# Altium project ECG BT&USB 12ch.PrjPcb
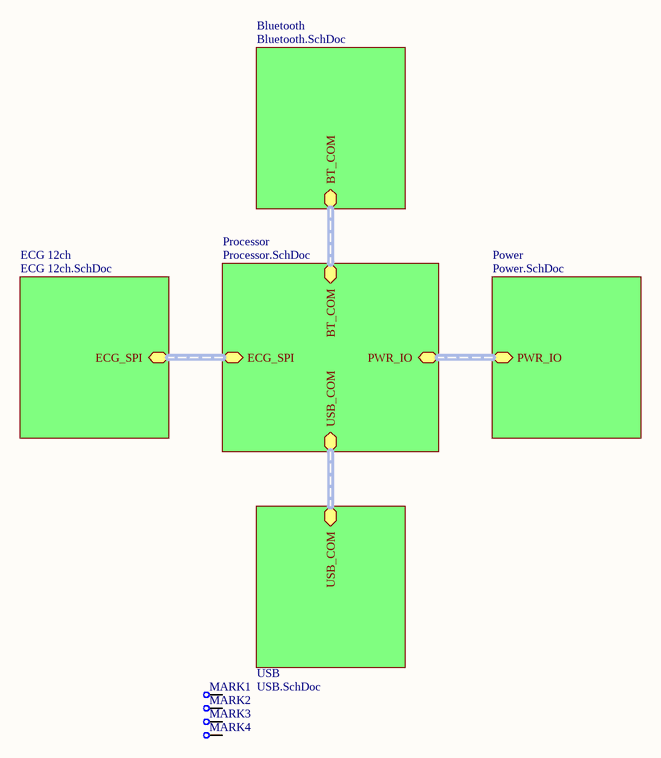
[diagram p0: Main 12ch.SchDoc]
7 sheets, 110 parts. Net scope: hierarchical (ports join the sheet entries above them; power ports are global).
Board file: ECG BT&USB 12ch.PcbDoc
Sheets:
  Main 12ch.SchDoc
    ECG 12ch = ECG 12ch.SchDoc
      Input protect 1 = Input protect.SchDoc
      Input protect 2 = Input protect.SchDoc
      Input protect 4 = Input protect.SchDoc
      Input protect 5 = Input protect.SchDoc
      Input protect 6 = Input protect.SchDoc
      Input protect 7 = Input protect.SchDoc
      Input protect 8 = Input protect.SchDoc
      Input protect 9 = Input protect.SchDoc
      Input protect 10 = Input protect.SchDoc
      Input protect 11 = Input protect.SchDoc
      Input protect 3 = Input protect.SchDoc
      Input connector 12ch = Input connector 12ch.SchDoc
    Processor = Processor.SchDoc
    Bluetooth = Bluetooth.SchDoc
    Power = Power.SchDoc

## Sheet Main 12ch.SchDoc
size A4

### Parts
MARK1  (no value)  [1MM MARK]
MARK2  (no value)  [1MM MARK]
MARK3  (no value)  [1MM MARK]
MARK4  (no value)  [1MM MARK]

### Sub-sheets
Bluetooth = Bluetooth.SchDoc: BT_COM (harness BT_COM)
ECG 12ch = ECG 12ch.SchDoc: ECG_SPI (harness ECG_SPI)
Power = Power.SchDoc: PWR_IO (harness PWR_IO)
Processor = Processor.SchDoc: ECG_SPI (harness ECG_SPI), BT_COM (harness BT_COM), USB_COM (harness USB_COM), PWR_IO (harness PWR_IO)
USB = USB.SchDoc (file not in this document): USB_COM (harness USB_COM)

### Nets

Not connected (* = marked no-connect by the designer): MARK1 1; MARK2 1; MARK3 1; MARK4 1

### Buses and harness runs
harness sheet Bluetooth/BT_COM = sheet Processor/BT_COM
harness sheet ECG 12ch/ECG_SPI = sheet Processor/ECG_SPI
harness sheet Power/PWR_IO = sheet Processor/PWR_IO
harness sheet Processor/USB_COM = sheet USB/USB_COM

### Library data of the parts
MARK1-MARK4 = TP

## Sheet ECG 12ch.SchDoc
size A4
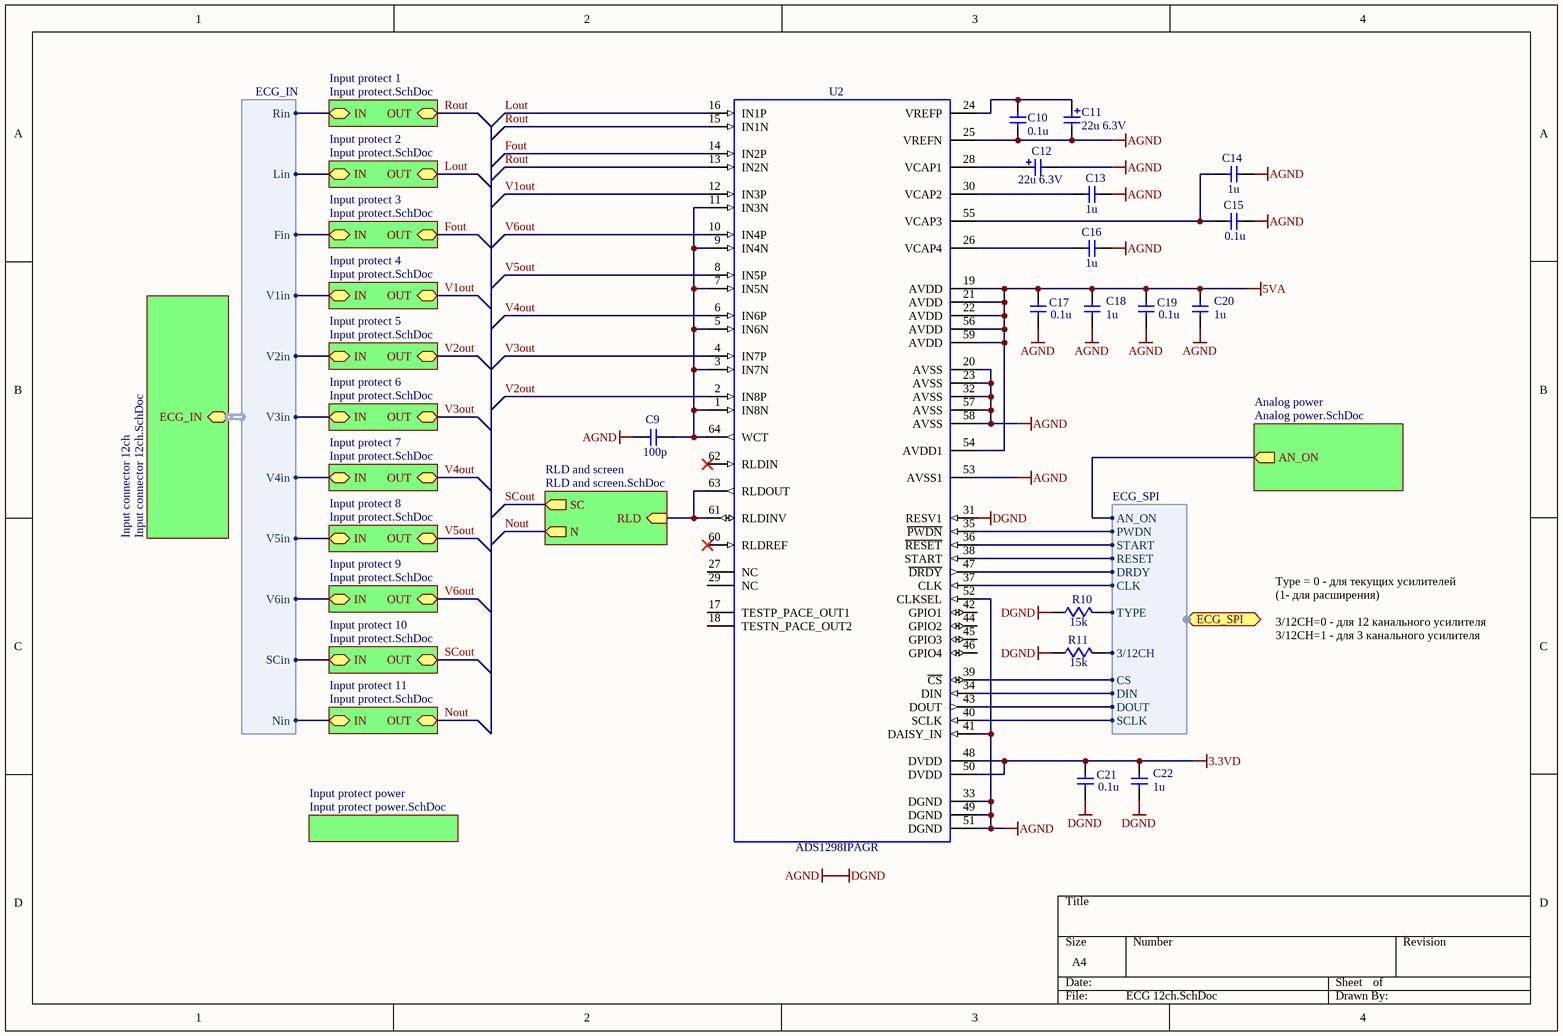
[diagram p1: ECG 12ch.SchDoc]

### Parts
C9  100p  [SMD/C/0603]
C10  0.1u  [SMD/C/0603]
C11  22u 6.3V  [SMD/C/TAJ-A]
C12  22u 6.3V  [SMD/C/TAJ-A]
C13  1u  [SMD/C/0603]
C14  1u  [SMD/C/0603]
C15  0.1u  [SMD/C/0603]
C16  1u  [SMD/C/0603]
C17  0.1u  [SMD/C/0603]
C18  1u  [SMD/C/0603]
C19  0.1u  [SMD/C/0603]
C20  1u  [SMD/C/0603]
C21  0.1u  [SMD/C/0603]
C22  1u  [SMD/C/0603]
R10  15k  [SMD/R/0603]
R11  15k  [SMD/R/0603]
U2  ADS1298IPAGR  [SMD/QFP64/0.5MMP/10x10MM/12X12MMWP]

### Sub-sheets
Analog power = Analog power.SchDoc (file not in this document): AN_ON (out)
Input connector 12ch = Input connector 12ch.SchDoc: ECG_IN (harness ECG_IN)
Input protect 1 = Input protect.SchDoc: IN, OUT
Input protect 2 = Input protect.SchDoc: IN, OUT
Input protect 3 = Input protect.SchDoc: IN, OUT
Input protect 4 = Input protect.SchDoc: IN, OUT
Input protect 5 = Input protect.SchDoc: IN, OUT
Input protect 6 = Input protect.SchDoc: IN, OUT
Input protect 7 = Input protect.SchDoc: IN, OUT
Input protect 8 = Input protect.SchDoc: IN, OUT
Input protect 9 = Input protect.SchDoc: IN, OUT
Input protect 10 = Input protect.SchDoc: IN, OUT
Input protect 11 = Input protect.SchDoc: IN, OUT
Input protect power = Input protect power.SchDoc (file not in this document): no entries
RLD and screen = RLD and screen.SchDoc (file not in this document): SC (out), N (out), RLD (in)

### Ports
ECG_SPI (harness ECG_SPI)

### Harnesses
ECG_SPI: PWDN, START, DRDY, CLK, DIN, CS, DOUT, SCLK, RESET, 3/12CH, TYPE, AN_ON
ECG_IN: Rin, Lin, Fin, V1in, V2in, V3in, V4in, V5in, V6in, SCin, Nin

### Nets
3.3VD: C21.2 C22.2 U2.48(DVDD) U2.50(DVDD)
5VA: C17.2 C18.2 C19.2 C20.2 U2.19(AVDD) U2.21(AVDD) U2.22(AVDD) U2.54(AVDD1) U2.56(AVDD) U2.59(AVDD)
AGND: C9.2 C10.1 C11.M C12.M C13.1 C14.1 C15.1 C16.1 C17.1 C18.1 C19.1 C20.1 C21.1 C22.1 R10.1 R11.1 U2.20(AVSS) U2.23(AVSS) U2.25(VREFN) U2.31(RESV1) U2.32(AVSS) U2.33(DGND) U2.41(DAISY_IN) U2.49(DGND) U2.51(DGND) U2.52(CLKSEL) U2.53(AVSS1) U2.57(AVSS) U2.58(AVSS)  [also labelled DGND]
ECG_ANON: sheet Analog power/AN_ON, port ECG_SPI.AN_ON
ECG_CH: R11.2 ; port ECG_SPI.3/12CH
ECG_CLK: U2.37(CLK) ; port ECG_SPI.CLK
ECG_CS: U2.39(~{CS}) ; port ECG_SPI.CS
ECG_DIN: U2.34(DIN) ; port ECG_SPI.DIN
ECG_DOUT: U2.43(DOUT) ; port ECG_SPI.DOUT
ECG_DRDY: U2.47(~{DRDY}) ; port ECG_SPI.DRDY
ECG_PWDN: U2.35(~{PWDN}) ; port ECG_SPI.PWDN
ECG_RST: U2.38(START) ; port ECG_SPI.RESET
ECG_SCLK: U2.40(SCLK) ; port ECG_SPI.SCLK
ECG_STRT: U2.36(~{RESET}) ; port ECG_SPI.START
ECG_TYPE: R10.2 ; port ECG_SPI.TYPE
Fout: U2.14(IN2P) ; sheet Input protect 3/OUT
Lout: U2.16(IN1P) ; sheet Input protect 2/OUT
Nout: sheet Input protect 11/OUT, sheet RLD and screen/N
Rout: U2.13(IN2N) U2.15(IN1N) ; sheet Input protect 1/OUT
SCout: sheet Input protect 10/OUT, sheet RLD and screen/SC
V1out: U2.12(IN3P) ; sheet Input protect 4/OUT
V2out: U2.2(IN8P) ; sheet Input protect 5/OUT
V3out: U2.4(IN7P) ; sheet Input protect 6/OUT
V4out: U2.6(IN6P) ; sheet Input protect 7/OUT
V5out: U2.8(IN5P) ; sheet Input protect 8/OUT
V6out: U2.10(IN4P) ; sheet Input protect 9/OUT
NetC9_1: C9.1 U2.1(IN8N) U2.3(IN7N) U2.5(IN6N) U2.7(IN5N) U2.9(IN4N) U2.11(IN3N) U2.64(WCT)
NetC10_2: C10.2 C11.P U2.24(VREFP)
NetC12_P: C12.P U2.28(VCAP1)
NetC13_2: C13.2 U2.30(VCAP2)
NetC14_2: C14.2 C15.2 U2.55(VCAP3)
NetC16_2: C16.2 U2.26(VCAP4)
NetR1.1_1: sheet Input protect 1/IN, sheet Input connector 12ch/ECG_IN.Rin
NetR1.2_1: sheet Input protect 2/IN, sheet Input connector 12ch/ECG_IN.Lin
NetR1.3_1: sheet Input protect 4/IN, sheet Input connector 12ch/ECG_IN.V1in
NetR1.4_1: sheet Input protect 5/IN, sheet Input connector 12ch/ECG_IN.V2in
NetR1.5_1: sheet Input protect 6/IN, sheet Input connector 12ch/ECG_IN.V3in
NetR1.6_1: sheet Input protect 7/IN, sheet Input connector 12ch/ECG_IN.V4in
NetR1.7_1: sheet Input protect 8/IN, sheet Input connector 12ch/ECG_IN.V5in
NetR1.8_1: sheet Input protect 9/IN, sheet Input connector 12ch/ECG_IN.V6in
NetR1.9_1: sheet Input protect 10/IN, sheet Input connector 12ch/ECG_IN.SCin
NetR1.10_1: sheet Input protect 11/IN, sheet Input connector 12ch/ECG_IN.Nin
NetR1.11_1: sheet Input protect 3/IN, sheet Input connector 12ch/ECG_IN.Fin
NetU2_61: U2.61(RLDINV) U2.63(RLDOUT) ; sheet RLD and screen/RLD

Not connected (* = marked no-connect by the designer): U2 17(TESTP_PACE_OUT1) 18(TESTN_PACE_OUT2) 27(NC) 29(NC) 42(GPIO1) 44(GPIO2) 45(GPIO3) 46(GPIO4) 60(RLDREF)* 62(RLDIN)*

### Notes on the sheet
- Type = 0 - для текущих усилителей
  (1- для расширения)
  3/12CH=0 - для 12 канального усилителя
  3/12CH=1 - для 3 канального усилителя

### Library data of the parts
C9 C10 C13-C22 = Capacitor
  C9: Value: 100p
  C10 C15 C17 C19 C21: Value: 0.1u
  C13 C14 C16 C18 C20 C22: Value: 1u
C11 C12 = Capacitor Pol: Value: 22u 6.3V
R10 R11 = Resistor: Value: 15k
U2 = ADS1298IPAGR: Interleaving Continuous Conduction Mode PFC Controller; Value: ADS1298IPAGR

## Sheet Input protect.SchDoc
size A4
Used 11 times, as channels ECG 12ch/Input protect 1, ECG 12ch/Input protect 2, ECG 12ch/Input protect 4, ECG 12ch/Input protect 5, ECG 12ch/Input protect 6, ECG 12ch/Input protect 7, ECG 12ch/Input protect 8, ECG 12ch/Input protect 9, ECG 12ch/Input protect 10, ECG 12ch/Input protect 11, ECG 12ch/Input protect 3. Parts and nets are listed once, with the designators drawn on the sheet.
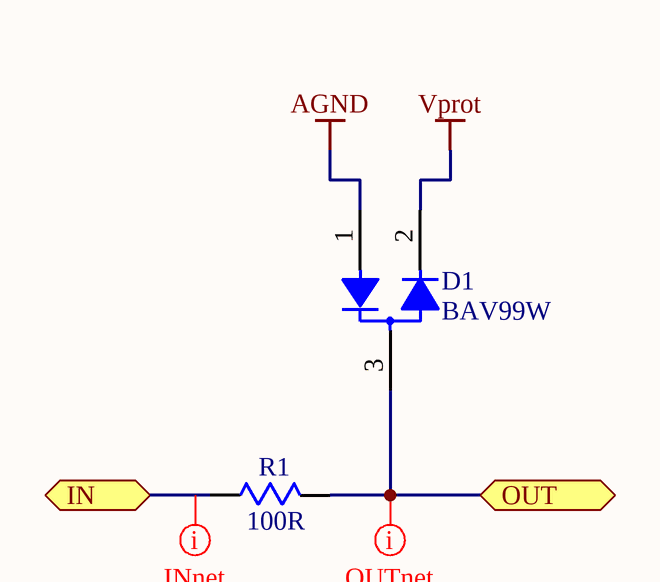
[diagram p2: Input protect.SchDoc]

### Parts
D1  BAV99W  [SMD/SOT323]
R1  100R  [SMD/R/0805]

### Ports
IN, OUT

### Nets
AGND: D1.1
Vprot: D1.2
IN: R1.1 ; port IN
OUT: D1.3 R1.2 ; port OUT

### Channels
ECG 12ch/Input protect 1: designators end in .1; ports IN=NetR1.1_1 OUT=Rout
ECG 12ch/Input protect 2: designators end in .2; ports IN=NetR1.2_1 OUT=Lout
ECG 12ch/Input protect 4: designators end in .3; ports IN=NetR1.3_1 OUT=V1out
ECG 12ch/Input protect 5: designators end in .4; ports IN=NetR1.4_1 OUT=V2out
ECG 12ch/Input protect 6: designators end in .5; ports IN=NetR1.5_1 OUT=V3out
ECG 12ch/Input protect 7: designators end in .6; ports IN=NetR1.6_1 OUT=V4out
ECG 12ch/Input protect 8: designators end in .7; ports IN=NetR1.7_1 OUT=V5out
ECG 12ch/Input protect 9: designators end in .8; ports IN=NetR1.8_1 OUT=V6out
ECG 12ch/Input protect 10: designators end in .9; ports IN=NetR1.9_1 OUT=SCout
ECG 12ch/Input protect 11: designators end in .10; ports IN=NetR1.10_1 OUT=Nout
ECG 12ch/Input protect 3: designators end in .11; ports IN=NetR1.11_1 OUT=Fout

### Layout directives
net class INnet: NetR1.1_1
net class OUTnet: Rout

### Library data of the parts
D1 = BAV99: Value: BAV99W
R1 = Resistor: Value: 100R

## Sheet Input connector 12ch.SchDoc
size A4
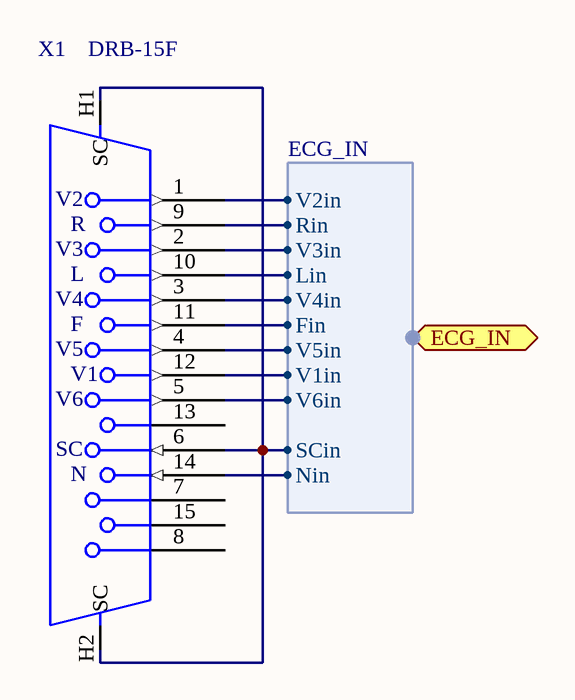
[diagram p3: Input connector 12ch.SchDoc]

### Parts
X1  DRB-15F  [DRB-15F]

### Ports
ECG_IN (harness ECG_IN)

### Harnesses
ECG_IN: Rin, Lin, Fin, V1in, V2in, V3in, V4in, V5in, V6in, SCin, Nin

### Nets
NetR1.1_1: X1.9 ; port ECG_IN.Rin
NetR1.2_1: X1.10 ; port ECG_IN.Lin
NetR1.3_1: X1.12 ; port ECG_IN.V1in
NetR1.4_1: X1.1 ; port ECG_IN.V2in
NetR1.5_1: X1.2 ; port ECG_IN.V3in
NetR1.6_1: X1.3 ; port ECG_IN.V4in
NetR1.7_1: X1.4 ; port ECG_IN.V5in
NetR1.8_1: X1.5 ; port ECG_IN.V6in
NetR1.9_1: X1.6 X1.H1(SC) X1.H2(SC) ; port ECG_IN.SCin
NetR1.10_1: X1.14 ; port ECG_IN.Nin
NetR1.11_1: X1.11 ; port ECG_IN.Fin

Not connected (* = marked no-connect by the designer): X1 7 8 13 15

### Notes on the sheet
- (in symbol ECG Cable DRB-15F) V2; R; V3; L; V4; F; V5; V1; V6; N

### Library data of the parts
X1 = ECG Cable DRB-15F: Value: DRB-15F

## Sheet Processor.SchDoc
size A3
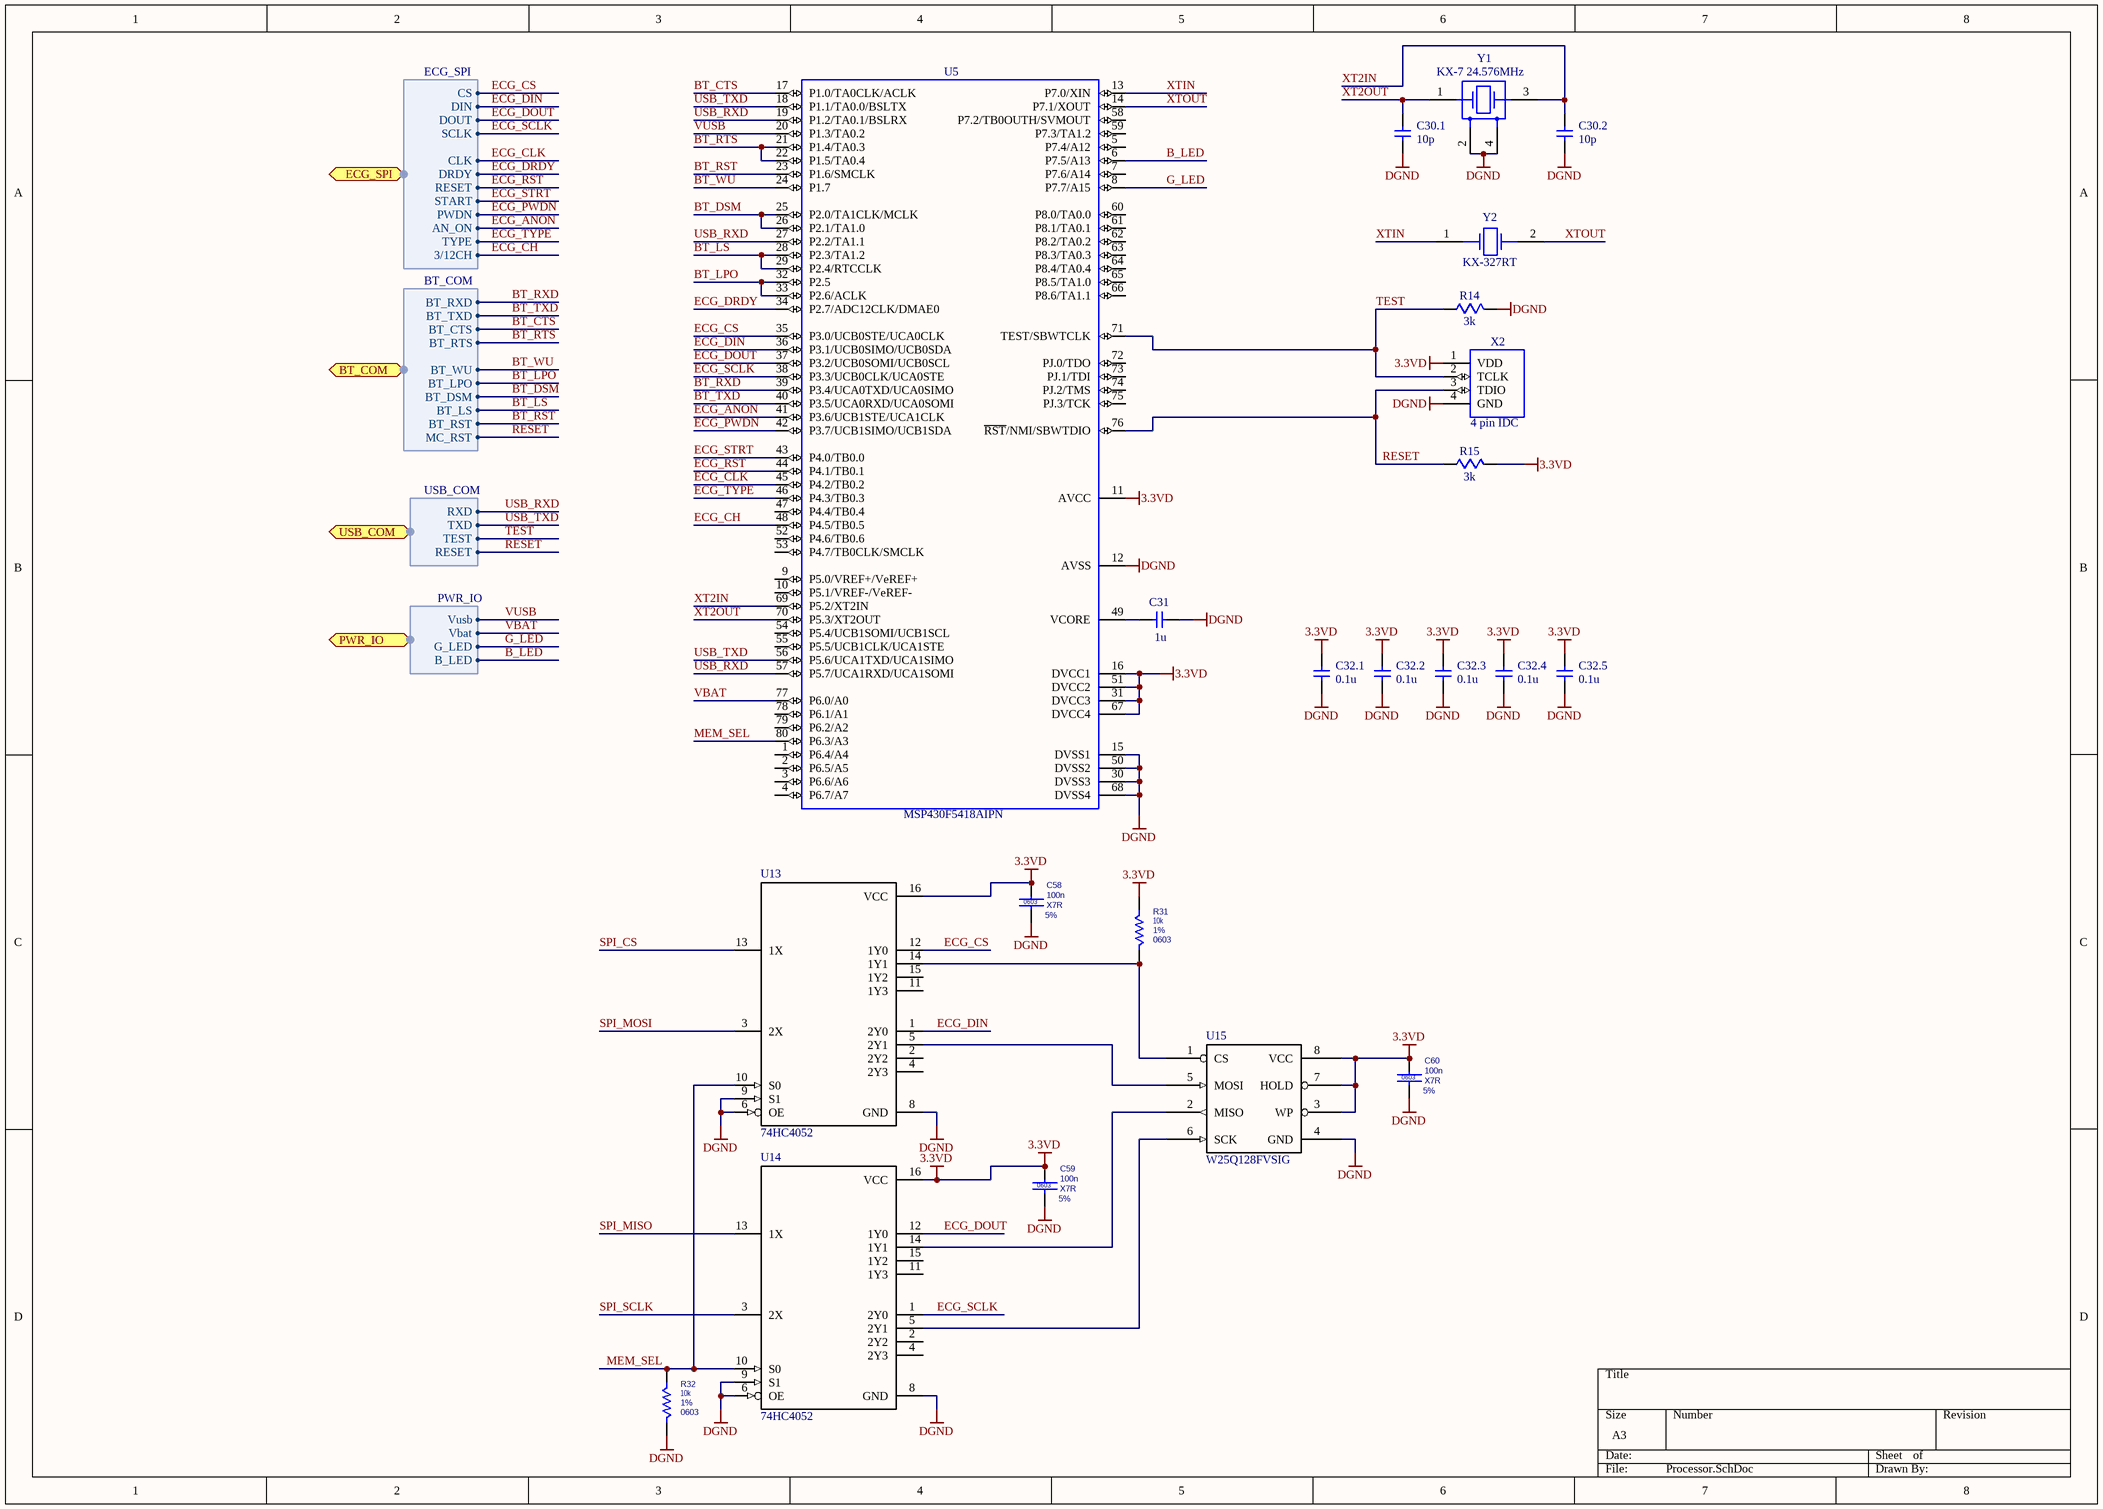
[diagram p4: Processor.SchDoc]

### Parts
C30.1  10p  [SMD/C/0603]
C30.2  10p  [SMD/C/0603]
C31  1u  [SMD/C/0603]
C32.1  0.1u  [SMD/C/0603]
C32.2  0.1u  [SMD/C/0603]
C32.3  0.1u  [SMD/C/0603]
C32.4  0.1u  [SMD/C/0603]
C32.5  0.1u  [SMD/C/0603]
C58  Tolerance: 5%  Case: 0603  Temperature Coefficient: X7R  [C0603]  (hidden comment: 100n)
C59  Tolerance: 5%  Case: 0603  Temperature Coefficient: X7R  [C0603]  (hidden comment: 100n)
C60  Tolerance: 5%  Case: 0603  Temperature Coefficient: X7R  [C0603]  (hidden comment: 100n)
R14  3k  [SMD/R/0603]
R15  3k  [SMD/R/0603]
R31  Case: 0603  Tolerance: 1%  [R0603]  (hidden comment: 10k)
R32  Case: 0603  Tolerance: 1%  [R0603]  (hidden comment: 10k)
U5  MSP430F5418AIPN  [SMD/QFP80/0.5MMP/12x12MM/14X14MMWP]
U13  74HC4052  [16-TSSOP]
U14  74HC4052  [16-TSSOP]
U15  W25Q128FVSIG
X2  4 pin IDC  [CONNECTOR/IDC/0.05P/1X4]
Y1  KX-7 24.576MHz  [KX-7]
Y2  KX-327RT  [KX–327RT]

### Ports
BT_COM (harness BT_COM), ECG_SPI (harness ECG_SPI), PWR_IO (harness PWR_IO), USB_COM (harness USB_COM)

### Harnesses
ECG_SPI: PWDN, START, DRDY, CLK, DIN, CS, DOUT, SCLK, RESET, 3/12CH, TYPE, AN_ON
BT_COM: BT_RXD, BT_TXD, BT_CTS, BT_RTS, BT_DSM, BT_WU, BT_LS, BT_RST, BT_LPO, MC_RST
USB_COM: RXD, TXD, TEST, RESET
PWR_IO: Vbat, Vusb, G_LED, B_LED

### Nets
3.3VD: C32.1.2 C32.2.2 C32.3.2 C32.4.2 C32.5.2 C58.1 C59.1 C60.1 R15.2 R31.1 U5.11(AVCC) U5.16(DVCC1) U5.31(DVCC3) U5.51(DVCC2) U5.67(DVCC4) U13.16(VCC) U14.16(VCC) U15.3(WP) U15.7(HOLD) U15.8(VCC) X2.1(VDD)
DGND: C30.1.1 C30.2.1 C31.1 C32.1.1 C32.2.1 C32.3.1 C32.4.1 C32.5.1 C58.2 C59.2 C60.2 R14.2 R32.2 U5.12(AVSS) U5.15(DVSS1) U5.30(DVSS3) U5.50(DVSS2) U5.68(DVSS4) U13.6(OE) U13.8(GND) U13.9(S1) U14.6(OE) U14.8(GND) U14.9(S1) U15.4(GND) X2.4(GND) Y1.2 Y1.4  [project net AGND]
B_LED: U5.6(P7.5/A13) ; port PWR_IO.B_LED
BT_CTS: U5.17(P1.0/TA0CLK/ACLK) ; port BT_COM.BT_CTS
BT_DSM: U5.25(P2.0/TA1CLK/MCLK) U5.26(P2.1/TA1.0) ; port BT_COM.BT_DSM
BT_LPO: U5.32(P2.5) U5.33(P2.6/ACLK) ; port BT_COM.BT_LPO
BT_LS: U5.28(P2.3/TA1.2) U5.29(P2.4/RTCCLK) ; port BT_COM.BT_LS
BT_RST: U5.23(P1.6/SMCLK) ; port BT_COM.BT_RST
BT_RTS: U5.21(P1.4/TA0.3) U5.22(P1.5/TA0.4) ; port BT_COM.BT_RTS
BT_RXD: U5.39(P3.4/UCA0TXD/UCA0SIMO) ; port BT_COM.BT_RXD
BT_TXD: U5.40(P3.5/UCA0RXD/UCA0SOMI) ; port BT_COM.BT_TXD
BT_WU: U5.24(P1.7) ; port BT_COM.BT_WU
ECG_ANON: U5.41(P3.6/UCB1STE/UCA1CLK) ; port ECG_SPI.AN_ON
ECG_CH: U5.48(P4.5/TB0.5) ; port ECG_SPI.3/12CH
ECG_CLK: U5.45(P4.2/TB0.2) ; port ECG_SPI.CLK
ECG_CS: U5.35(P3.0/UCB0STE/UCA0CLK) U13.12(1Y0) ; port ECG_SPI.CS
ECG_DIN: U5.36(P3.1/UCB0SIMO/UCB0SDA) U13.1(2Y0) ; port ECG_SPI.DIN
ECG_DOUT: U5.37(P3.2/UCB0SOMI/UCB0SCL) U14.12(1Y0) ; port ECG_SPI.DOUT
ECG_DRDY: U5.34(P2.7/ADC12CLK/DMAE0) ; port ECG_SPI.DRDY
ECG_PWDN: U5.42(P3.7/UCB1SIMO/UCB1SDA) ; port ECG_SPI.PWDN
ECG_RST: U5.44(P4.1/TB0.1) ; port ECG_SPI.RESET
ECG_SCLK: U5.38(P3.3/UCB0CLK/UCA0STE) U14.1(2Y0) ; port ECG_SPI.SCLK
ECG_STRT: U5.43(P4.0/TB0.0) ; port ECG_SPI.START
ECG_TYPE: U5.46(P4.3/TB0.3) ; port ECG_SPI.TYPE
G_LED: U5.8(P7.7/A15) ; port PWR_IO.G_LED
MEM_SEL: R32.1 U5.80(P6.3/A3) U13.10(S0) U14.10(S0)
RESET: R15.1 U5.76(~{RST}/NMI/SBWTDIO) X2.3(TDIO) ; port BT_COM.MC_RST, port USB_COM.RESET
SPI_CS: U13.13(1X)
SPI_MISO: U14.13(1X)
SPI_MOSI: U13.3(2X)
SPI_SCLK: U14.3(2X)
TEST: R14.1 U5.71(TEST/SBWTCLK) X2.2(TCLK) ; port USB_COM.TEST
USB_RXD: U5.19(P1.2/TA0.1/BSLRX) U5.27(P2.2/TA1.1) U5.57(P5.7/UCA1RXD/UCA1SOMI) ; port USB_COM.RXD
USB_TXD: U5.18(P1.1/TA0.0/BSLTX) U5.56(P5.6/UCA1TXD/UCA1SIMO) ; port USB_COM.TXD
VBAT: U5.77(P6.0/A0) ; port PWR_IO.Vbat
VUSB: U5.20(P1.3/TA0.2) ; port PWR_IO.Vusb
XT2IN: C30.2.2 U5.69(P5.2/XT2IN) Y1.3
XT2OUT: C30.1.2 U5.70(P5.3/XT2OUT) Y1.1
XTIN: U5.13(P7.0/XIN) Y2.1
XTOUT: U5.14(P7.1/XOUT) Y2.2
NetC31_2: C31.2 U5.49(VCORE)
NetR31_2: R31.2 U13.14(1Y1) U15.1(CS)
NetU13_5: U13.5(2Y1) U15.5(MOSI)
NetU14_5: U14.5(2Y1) U15.6(SCK)
NetU14_14: U14.14(1Y1) U15.2(MISO)

Not connected (* = marked no-connect by the designer): U5 1(P6.4/A4) 2(P6.5/A5) 3(P6.6/A6) 4(P6.7/A7) 5(P7.4/A12) 7(P7.6/A14) 9(P5.0/VREF+/VeREF+) 10(P5.1/VREF-/VeREF-) 47(P4.4/TB0.4) 52(P4.6/TB0.6) 53(P4.7/TB0CLK/SMCLK) 54(P5.4/UCB1SOMI/UCB1SCL) 55(P5.5/UCB1CLK/UCA1STE) 58(P7.2/TB0OUTH/SVMOUT) 59(P7.3/TA1.2) 60(P8.0/TA0.0) 61(P8.1/TA0.1) 62(P8.2/TA0.2) 63(P8.3/TA0.3) 64(P8.4/TA0.4) 65(P8.5/TA1.0) 66(P8.6/TA1.1) 72(PJ.0/TDO) 73(PJ.1/TDI) 74(PJ.2/TMS) 75(PJ.3/TCK) 78(P6.1/A1) 79(P6.2/A2); U13 2(2Y2) 4(2Y3) 11(1Y3) 15(1Y2); U14 2(2Y2) 4(2Y3) 11(1Y3) 15(1Y2)

### Library data of the parts
C30.1 C30.2 C31 C32.1-C32.5 = Capacitor
  C30.1 C30.2: Value: 10p
  C31: Value: 1u
  C32.1-C32.5: Value: 0.1u
C58-C60 = CC0603K-X7R-50V-100N: CAPACITOR; Voltage: 50V; Value: 100n; Part Number: CC0603K-X7R-50V-100N; ComponentLink2Description: Datasheet; Digikey ID: 399-7844-1-ND
R14 R15 = Resistor: Value: 3k
R31 R32 = RC0603-10K0: RES, 10K OHM, 1/10W, 1%, 0603, RoHS; Manufacturer: PHILIPS, SAMSUNG; Manufacturer Part Number: RC1608F103CS; Critical: NO; Value: 10k; Part Number: RC0603-10K0; Power: 1/10W; Temperature: -55 - +155 C; ComponentLink2Description: Datasheet; ComponentLink2URL: http://www.yageo.com/pdf/PYu-RC0603_51_RoHS_L_4.pdf; Publisher: tkondratyuk; RoHS Compliant: YES; Digikey ID: 1276-3485-1-ND
U5 = MSP430F5418AIPN: Mixed Signal Microcontroller; Value: MSP430F5418AIPN
U13 U14 = 74HC4052: IC MUX/DEMUX DUAL 4X1 16TSSOP; Manufacturer: TI; Manufacturer Part Number: CD74HC4052PWR; Part Number: 74HC4052; Stock ID: 296-17619-1-ND; Temperature: -55°C ~ 125°C; Digikey ID: 296-17619-1-ND
U15 = W25Q128: IC FLASH 128MBIT 104MHZ 8SOIC; Part Number: W25Q128; Stock ID: W25Q128FVSIG-ND; Temperature: -40°C ~ 85°C (TA); Case: SOIC8; Manufacturer Part Number: W25Q128FVSIG; Digikey ID: W25Q128FVSIG-ND
X2 = MSP430 JTAG SBW: MSP430 JTAG Connector; Value: 4 pin IDC
Y1 = KX-9A: Quartz Crystal; Value: KX-7 24.576MHz
Y2 = KX-327RT: Quartz Crystal; Value: KX-327RT

## Sheet Bluetooth.SchDoc
size A4
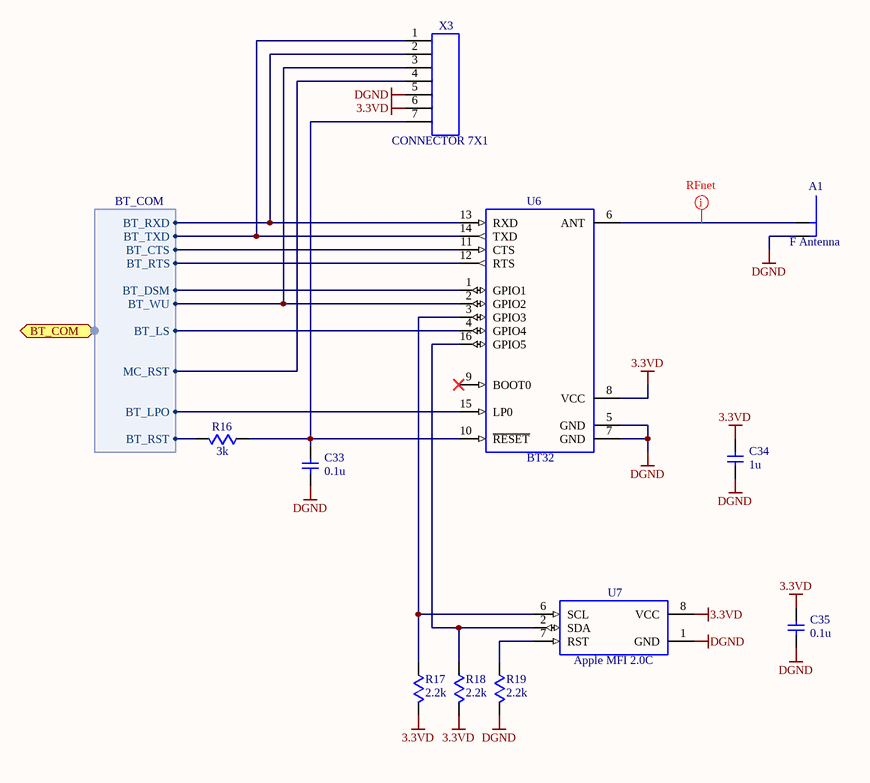
[diagram p5: Bluetooth.SchDoc]

### Parts
A1  F Antenna  [PCB inverted F antenna mirror]  (net tie, no BOM)
C33  0.1u  [SMD/C/0603]
C34  1u  [SMD/C/0603]
C35  0.1u  [SMD/C/0603]
R16  3k  [SMD/R/0603]
R17  2.2k  [SMD/R/0603]
R18  2.2k  [SMD/R/0603]
R19  2.2k  [SMD/R/0603]
U6  BT32  [BT32]
U7  Apple MFI 2.0C  [Apple MFI 2.0C]
X3  CONNECTOR 7X1  [CONNECTOR/IDC/0.05P/1X7]

### Ports
BT_COM (harness BT_COM)

### Harnesses
BT_COM: BT_RXD, BT_TXD, BT_CTS, BT_RTS, BT_DSM, BT_LPO, BT_LS, BT_RST, BT_WU, MC_RST

### Nets
3.3VD: C34.2 C35.2 R17.2 R18.2 U6.8(VCC) U7.8(VCC) X3.6
DGND: A1.2 C33.1 C34.1 C35.1 R19.2 U6.5(GND) U6.7(GND) U7.1(GND) X3.5  [project net AGND]
BT_CTS: U6.11(CTS) ; port BT_COM.BT_CTS
BT_DSM: U6.1(GPIO1) ; port BT_COM.BT_DSM
BT_LPO: U6.15(LP0) ; port BT_COM.BT_LPO
BT_LS: U6.4(GPIO4) ; port BT_COM.BT_LS
BT_RST: R16.2 ; port BT_COM.BT_RST
BT_RTS: U6.12(RTS) ; port BT_COM.BT_RTS
BT_RXD: U6.13(RXD) X3.2 ; port BT_COM.BT_RXD
BT_TXD: U6.14(TXD) X3.1 ; port BT_COM.BT_TXD
BT_WU: U6.2(GPIO2) X3.3 ; port BT_COM.BT_WU
RESET: X3.4 ; port BT_COM.MC_RST
NetA1_1: A1.1 U6.6(ANT)
NetC33_2: C33.2 R16.1 U6.10(~{RESET}) X3.7
NetR17_1: R17.1 U6.3(GPIO3) U7.6(SCL)
NetR18_1: R18.1 U6.16(GPIO5) U7.2(SDA)
NetR19_1: R19.1 U7.7(RST)

Not connected (* = marked no-connect by the designer): U6 9(BOOT0)*

### Layout directives
net class RFnet: NetA1_1

### Library data of the parts
C33-C35 = Capacitor
  C33 C35: Value: 0.1u
  C34: Value: 1u
R16-R19 = Resistor
  R16: Value: 3k
  R17-R19: Value: 2.2k
U6 = BT32: Bluetooth module; Value: BT32
U7 = Apple MFI 2.0C: Apple Authentication Coprocessor 2.0C; Value: Apple MFI 2.0C
A1 = F Antenna: Value: F Antenna
X3 = CONNECTOR 7X1: Value: CONNECTOR 7X1

## Sheet Power.SchDoc
size A4
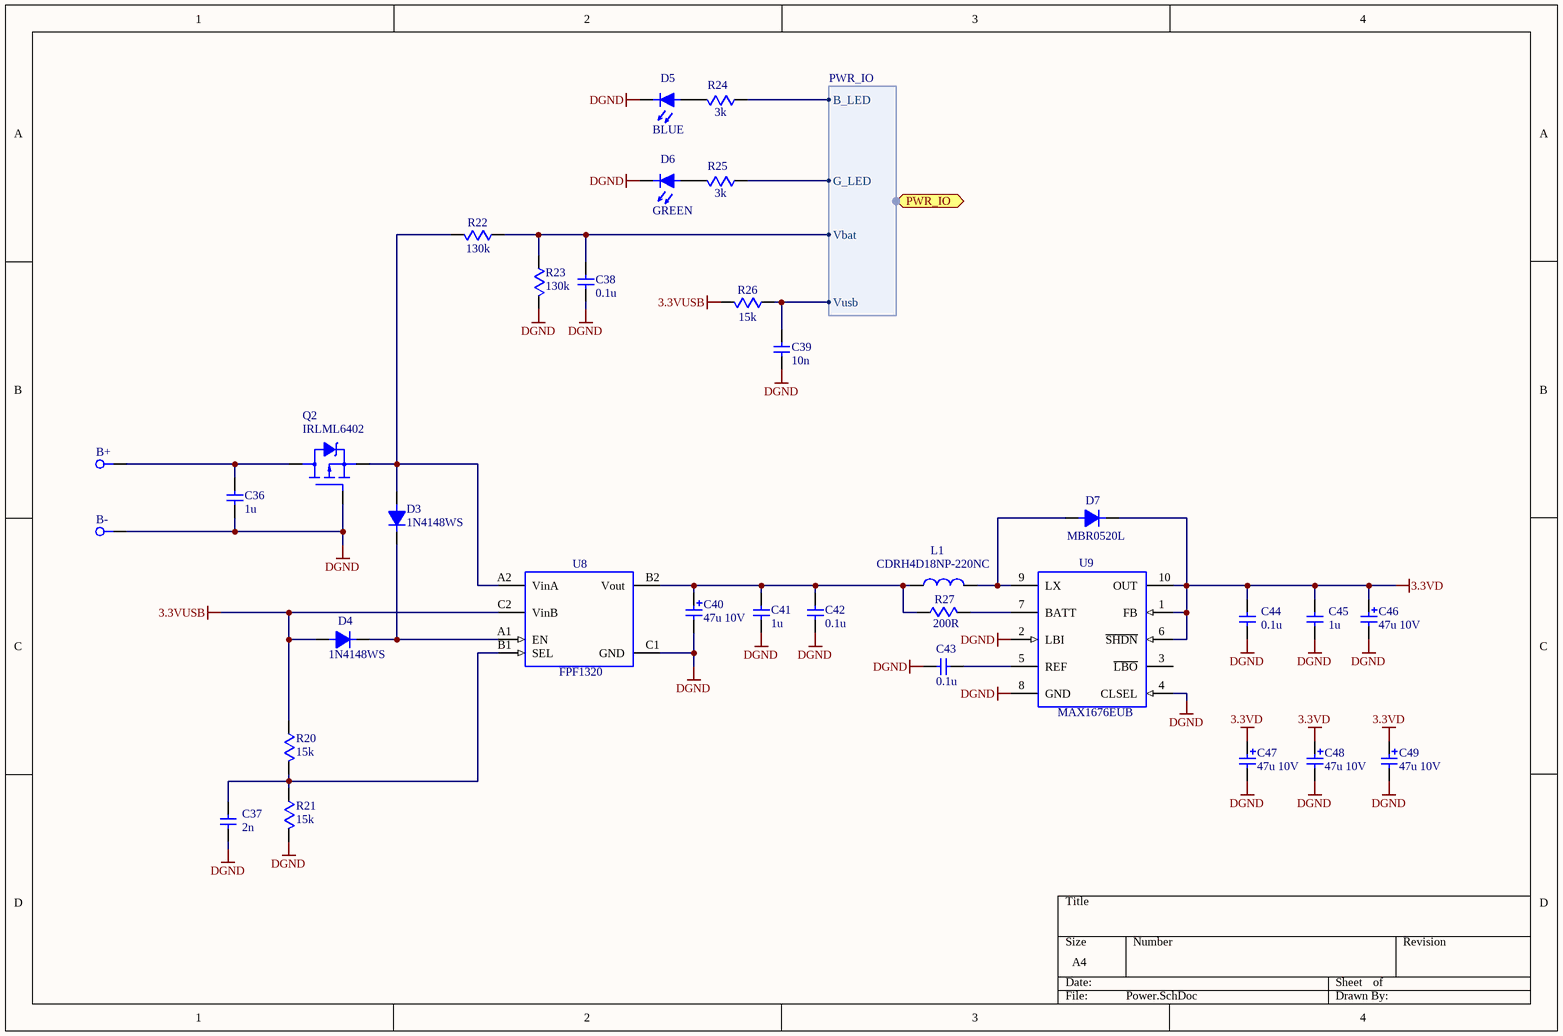
[diagram p6: Power.SchDoc]

### Parts
B+  TH HOLE  [1.0MM PAD]  (value not drawn)
B-  TH HOLE  [1.0MM PAD]  (value not drawn)
C36  1u  [SMD/C/0603]
C37  2n  [SMD/C/0603]
C38  0.1u  [SMD/C/0603]
C39  10n  [SMD/C/0603]
C40  47u 10V  [SMD/C/TAJ-B]
C41  1u  [SMD/C/0603]
C42  0.1u  [SMD/C/0603]
C43  0.1u  [SMD/C/0603]
C44  0.1u  [SMD/C/0603]
C45  1u  [SMD/C/0603]
C46  47u 10V  [SMD/C/TAJ-B]
C47  47u 10V  [SMD/C/TAJ-B]
C48  47u 10V  [SMD/C/TAJ-B]
C49  47u 10V  [SMD/C/TAJ-B]
D3  1N4148WS  [SMD/SOD-323]
D4  1N4148WS  [SMD/SOD-323]
D5  BLUE  [SMD/LED/0603]
D6  GREEN  [SMD/LED/0603]
D7  MBR0520L  [SMD/SOD-123]
L1  CDRH4D18NP-220NC  [SMD\L\SUMIDA\CDRH4D18]
Q2  IRLML6402  [SMD/SOT23]
R20  15k  [SMD/R/0603]
R21  15k  [SMD/R/0603]
R22  130k  [SMD/R/0603]
R23  130k  [SMD/R/0603]
R24  3k  [SMD/R/0603]
R25  3k  [SMD/R/0603]
R26  15k  [SMD/R/0603]
R27  200R  [SMD/R/0603]
U8  FPF1320  [SMD/BGA6/1.46x0.96MM/0.5MMP/0.25MMBALL/0.625MMH]
U9  MAX1676EUB  [SMD/SOP10/0.5MMP/3x3MM/4.9MMWP]

### Ports
PWR_IO (harness PWR_IO)

### Harnesses
PWR_IO: Vbat, Vusb, B_LED, G_LED

### Nets
3.3VD: C44.2 C45.2 C46.P C47.P C48.P C49.P D7.C U9.1(FB) U9.6(~{SHDN}) U9.10(OUT)
3.3VUSB: D4.A R20.1 R26.2 U8.C2(VinB)
DGND: B-.1 C36.1 C37.1 C38.1 C39.1 C40.M C41.1 C42.1 C43.2 C44.1 C45.1 C46.M C47.M C48.M C49.M D5.C D6.C Q2.1(G) R21.2 R23.2 U8.C1(GND) U9.2(LBI) U9.4(CLSEL) U9.8(GND)  [project net AGND]
B_LED: R24.1 ; port PWR_IO.B_LED
G_LED: R25.1 ; port PWR_IO.G_LED
VBAT: C38.2 R22.1 R23.1 ; port PWR_IO.Vbat
VUSB: C39.2 R26.1 ; port PWR_IO.Vusb
NetB+_1: B+.1 C36.2 Q2.3(D)
NetC37_2: C37.2 R20.2 R21.1 U8.B1(SEL)
NetC40_P: C40.P C41.2 C42.2 L1.1 R27.1 U8.B2(Vout)
NetC43_1: C43.1 U9.5(REF)
NetD3_A: D3.A Q2.2(S) R22.2 U8.A2(VinA)
NetD3_C: D3.C D4.C U8.A1(EN)
NetD5_A: D5.A R24.2
NetD6_A: D6.A R25.2
NetD7_A: D7.A L1.2 U9.9(LX)
NetR27_2: R27.2 U9.7(BATT)

Not connected (* = marked no-connect by the designer): U9 3(~{LBO})

### Library data of the parts
C36-C39 C41-C45 = Capacitor
  C36 C41 C45: Value: 1u
  C37: Value: 2n
  C38 C42-C44: Value: 0.1u
  C39: Value: 10n
C40 C46-C49 = Capacitor Pol: Value: 47u 10V
D3 D4 D7 = Diode
  D3 D4: Value: 1N4148WS
  D7: Value: MBR0520L
D5 D6 = LED: d3mm Ultra Brightness Blue LED
  D5: Value: BLUE
  D6: Value: GREEN
L1 = CDRH4D: Value: CDRH4D18NP-220NC
Q2 = IRLML6402: P-channel HEXFET Power MOSFET; Value: IRLML6402
R20-R27 = Resistor
  R20 R21 R26: Value: 15k
  R22 R23: Value: 130k
  R24 R25: Value: 3k
  R27: Value: 200R
U8 = FPF1320: Power Switch; Value: FPF1320
U9 = MAX1676EUB: High-Efficiency, Low-Supply-Current, Compact, Step-Up DC-DC Converters; Value: MAX1676EUB
B+ B- = TH HOLE: Value: TH HOLE

## Nets that join several sheets
3.3VD: ECG 12ch (C21.2 C22.2 U2.48 U2.50), Processor (21 pins), Bluetooth (7 pins), Power (10 pins)
AGND: ECG 12ch (29 pins), ECG 12ch/Input protect 1 (D1.1.1), ECG 12ch/Input protect 2 (D1.2.1), ECG 12ch/Input protect 4 (D1.3.1), ECG 12ch/Input protect 5 (D1.4.1), ECG 12ch/Input protect 6 (D1.5.1), ECG 12ch/Input protect 7 (D1.6.1), ECG 12ch/Input protect 8 (D1.7.1), ECG 12ch/Input protect 9 (D1.8.1), ECG 12ch/Input protect 10 (D1.9.1), ECG 12ch/Input protect 11 (D1.10.1), ECG 12ch/Input protect 3 (D1.11.1), Processor (28 pins), Bluetooth (9 pins), Power (24 pins)
Vprot: ECG 12ch/Input protect 1 (D1.1.2), ECG 12ch/Input protect 2 (D1.2.2), ECG 12ch/Input protect 4 (D1.3.2), ECG 12ch/Input protect 5 (D1.4.2), ECG 12ch/Input protect 6 (D1.5.2), ECG 12ch/Input protect 7 (D1.6.2), ECG 12ch/Input protect 8 (D1.7.2), ECG 12ch/Input protect 9 (D1.8.2), ECG 12ch/Input protect 10 (D1.9.2), ECG 12ch/Input protect 11 (D1.10.2), ECG 12ch/Input protect 3 (D1.11.2)
B_LED: Processor (U5.6), Power (R24.1)
BT_CTS: Processor (U5.17), Bluetooth (U6.11)
BT_DSM: Processor (U5.25 U5.26), Bluetooth (U6.1)
BT_LPO: Processor (U5.32 U5.33), Bluetooth (U6.15)
BT_LS: Processor (U5.28 U5.29), Bluetooth (U6.4)
BT_RST: Processor (U5.23), Bluetooth (R16.2)
BT_RTS: Processor (U5.21 U5.22), Bluetooth (U6.12)
BT_RXD: Processor (U5.39), Bluetooth (U6.13 X3.2)
BT_TXD: Processor (U5.40), Bluetooth (U6.14 X3.1)
BT_WU: Processor (U5.24), Bluetooth (U6.2 X3.3)
ECG_CH: ECG 12ch (R11.2), Processor (U5.48)
ECG_CLK: ECG 12ch (U2.37), Processor (U5.45)
ECG_CS: ECG 12ch (U2.39), Processor (U5.35 U13.12)
ECG_DIN: ECG 12ch (U2.34), Processor (U5.36 U13.1)
ECG_DOUT: ECG 12ch (U2.43), Processor (U5.37 U14.12)
ECG_DRDY: ECG 12ch (U2.47), Processor (U5.34)
ECG_PWDN: ECG 12ch (U2.35), Processor (U5.42)
ECG_RST: ECG 12ch (U2.38), Processor (U5.44)
ECG_SCLK: ECG 12ch (U2.40), Processor (U5.38 U14.1)
ECG_STRT: ECG 12ch (U2.36), Processor (U5.43)
ECG_TYPE: ECG 12ch (R10.2), Processor (U5.46)
Fout: ECG 12ch (U2.14), ECG 12ch/Input protect 3 (D1.11.3 R1.11.2)
G_LED: Processor (U5.8), Power (R25.1)
Lout: ECG 12ch (U2.16), ECG 12ch/Input protect 2 (D1.2.3 R1.2.2)
NetR1.1_1: ECG 12ch/Input protect 1 (R1.1.1), Input connector 12ch (X1.9)
NetR1.2_1: ECG 12ch/Input protect 2 (R1.2.1), Input connector 12ch (X1.10)
NetR1.3_1: ECG 12ch/Input protect 4 (R1.3.1), Input connector 12ch (X1.12)
NetR1.4_1: ECG 12ch/Input protect 5 (R1.4.1), Input connector 12ch (X1.1)
NetR1.5_1: ECG 12ch/Input protect 6 (R1.5.1), Input connector 12ch (X1.2)
NetR1.6_1: ECG 12ch/Input protect 7 (R1.6.1), Input connector 12ch (X1.3)
NetR1.7_1: ECG 12ch/Input protect 8 (R1.7.1), Input connector 12ch (X1.4)
NetR1.8_1: ECG 12ch/Input protect 9 (R1.8.1), Input connector 12ch (X1.5)
NetR1.9_1: ECG 12ch/Input protect 10 (R1.9.1), Input connector 12ch (X1.6 X1.H1 X1.H2)
NetR1.10_1: ECG 12ch/Input protect 11 (R1.10.1), Input connector 12ch (X1.14)
NetR1.11_1: ECG 12ch/Input protect 3 (R1.11.1), Input connector 12ch (X1.11)
RESET: Processor (R15.1 U5.76 X2.3), Bluetooth (X3.4)
Rout: ECG 12ch (U2.13 U2.15), ECG 12ch/Input protect 1 (D1.1.3 R1.1.2)
V1out: ECG 12ch (U2.12), ECG 12ch/Input protect 4 (D1.3.3 R1.3.2)
V2out: ECG 12ch (U2.2), ECG 12ch/Input protect 5 (D1.4.3 R1.4.2)
V3out: ECG 12ch (U2.4), ECG 12ch/Input protect 6 (D1.5.3 R1.5.2)
V4out: ECG 12ch (U2.6), ECG 12ch/Input protect 7 (D1.6.3 R1.6.2)
V5out: ECG 12ch (U2.8), ECG 12ch/Input protect 8 (D1.7.3 R1.7.2)
V6out: ECG 12ch (U2.10), ECG 12ch/Input protect 9 (D1.8.3 R1.8.2)
VBAT: Processor (U5.77), Power (C38.2 R22.1 R23.1)
VUSB: Processor (U5.20), Power (C39.2 R26.1)